# EAGLE schematic NIRGM V8_support (EAGLE 8.5.1)
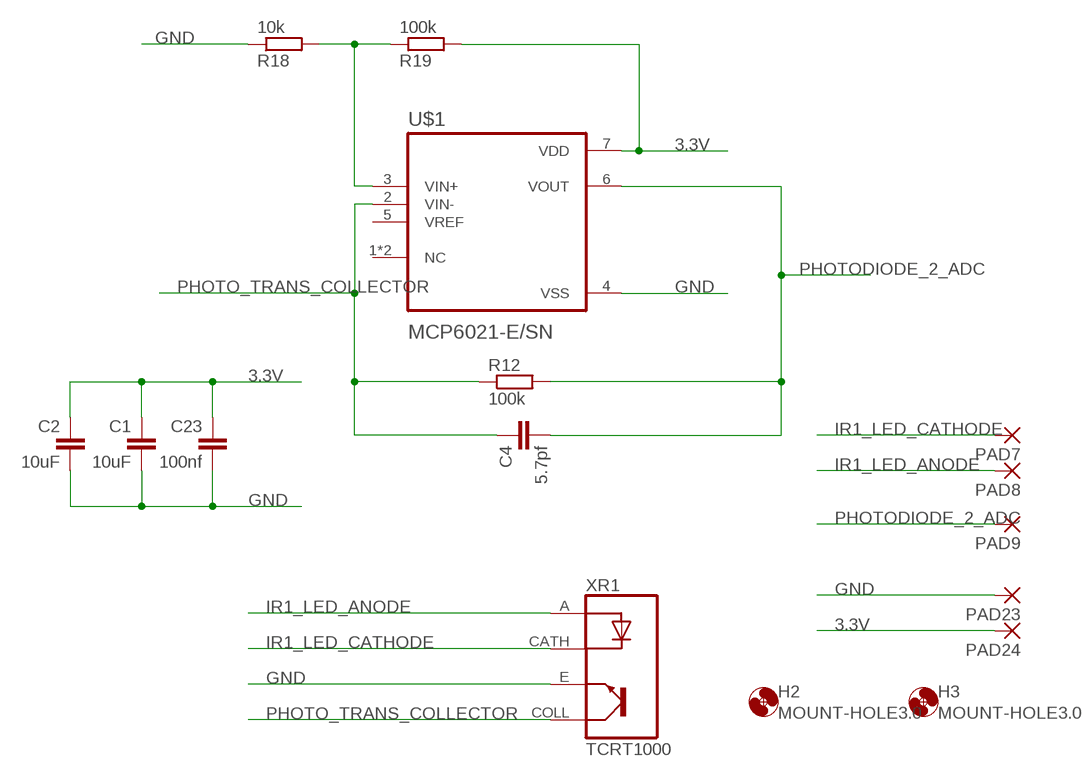
[diagram p0: schematic, sheet 1]

## Parts
C1  10uF  C-EUC1206K  [C1206K]
C2  10uF  C-EUC1206K  [C1206K]
C4  5.7pf  C-EUC1206K  [C1206K]
C23  100nf  C-EUC1206K  [C1206K]
H2  MOUNT-HOLE3.0  [3,0]
H3  MOUNT-HOLE3.0  [3,0]
PAD7  SMD2  [SMD1,27-2,54]
PAD8  SMD2  [SMD1,27-2,54]
PAD9  SMD2  [SMD1,27-2,54]
PAD23  SMD2  [SMD1,27-2,54]
PAD24  SMD2  [SMD1,27-2,54]
R12  100k  R-EU_R1206  [R1206]
R18  10k  R-EU_R1206  [R1206]
R19  100k  R-EU_R1206  [R1206]
U$1  MCP6021-E/SN  [SOIC127P600X175-8N]
XR1  TCRT1000  [XDCR_TCRT1000]

## Nets
3.3V: C1.1 C2.1 C23.1 PAD24.1(P) R19.2 U$1.7(VDD)
GND: C1.2 C2.2 C23.2 PAD23.1(P) R18.1 U$1.4(VSS) XR1.E
IR1_LED_ANODE: PAD8.1(P) XR1.A
IR1_LED_CATHODE: PAD7.1(P) XR1.CATH(C)
N$10: R18.2 R19.1 U$1.3(VIN+)
PHOTO_TRANS_COLLECTOR: C4.1 R12.1 U$1.2(VIN-) XR1.COLL(CO)
PHOTODIODE_2_ADC: C4.2 PAD9.1(P) R12.2 U$1.6(VOUT)
Unconnected: U$1.1(NC) U$1.5(VREF) U$1.8(NC)

## Library data of the parts
C1 C2 C4 C23 = rcl:C-EU: CAPACITOR, European symbol; SPICEPREFIX: C
H2 H3 = holes:MOUNT-HOLE: MOUNTING HOLE with drill center marker
PAD7-PAD9 PAD23 PAD24 = wirepad:SMD2: SMD PAD
R12 R18 R19 = rcl:R-EU_: RESISTOR, European symbol; SPICEPREFIX: R
U$1 = MCP6021-E_SN:MCP6021-E/SN; AVAILABILITY: Unavailable; DESCRIPTION: MCP6021 Series 5.5 V 10 MHz Rail-to-Rail I/O Operational Amplifier-SOIC-8; MF: Microchip; MP: MCP6021-E/SN; PACKAGE: SOIC-8 Microchip; PRICE: None
XR1 = TCRT1000:TCRT1000: Optical Sensor The TCRT1000 and TCRT1010 are reflective sensors which include an infrared emitter and phototransistor in a leaded package which blocks visible light; AVAILABILITY: Unavailable; DESCRIPTION: 950 nm 50 mA Through Hole Reflective Optical Sensor with Transistor Output; MF: Vishay; MP: TCRT1000; PACKAGE: PCB Mount Vishay; PRICE: None